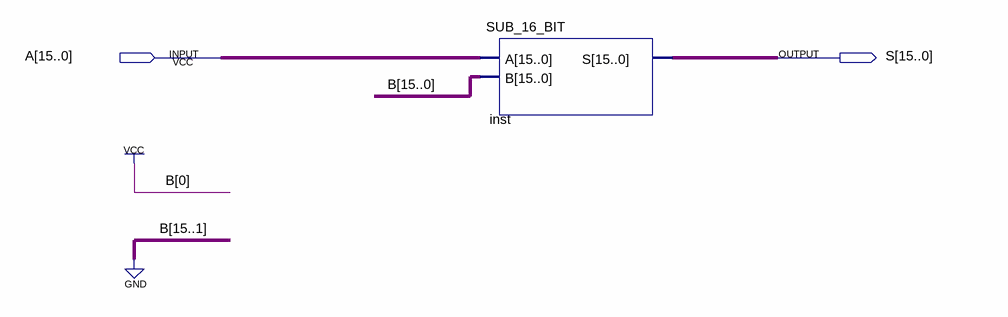
[diagram p0: schematic sheet]
// Quartus schematic SUB_1.bdf as structural Verilog: 1 symbols, 2 pins
module SUB_1 (
  input  [15:0] A,
  output [15:0] S
);

  SUB_16_BIT inst (.A(A), .B(16'b0000000000000001), .S(S));
endmodule
